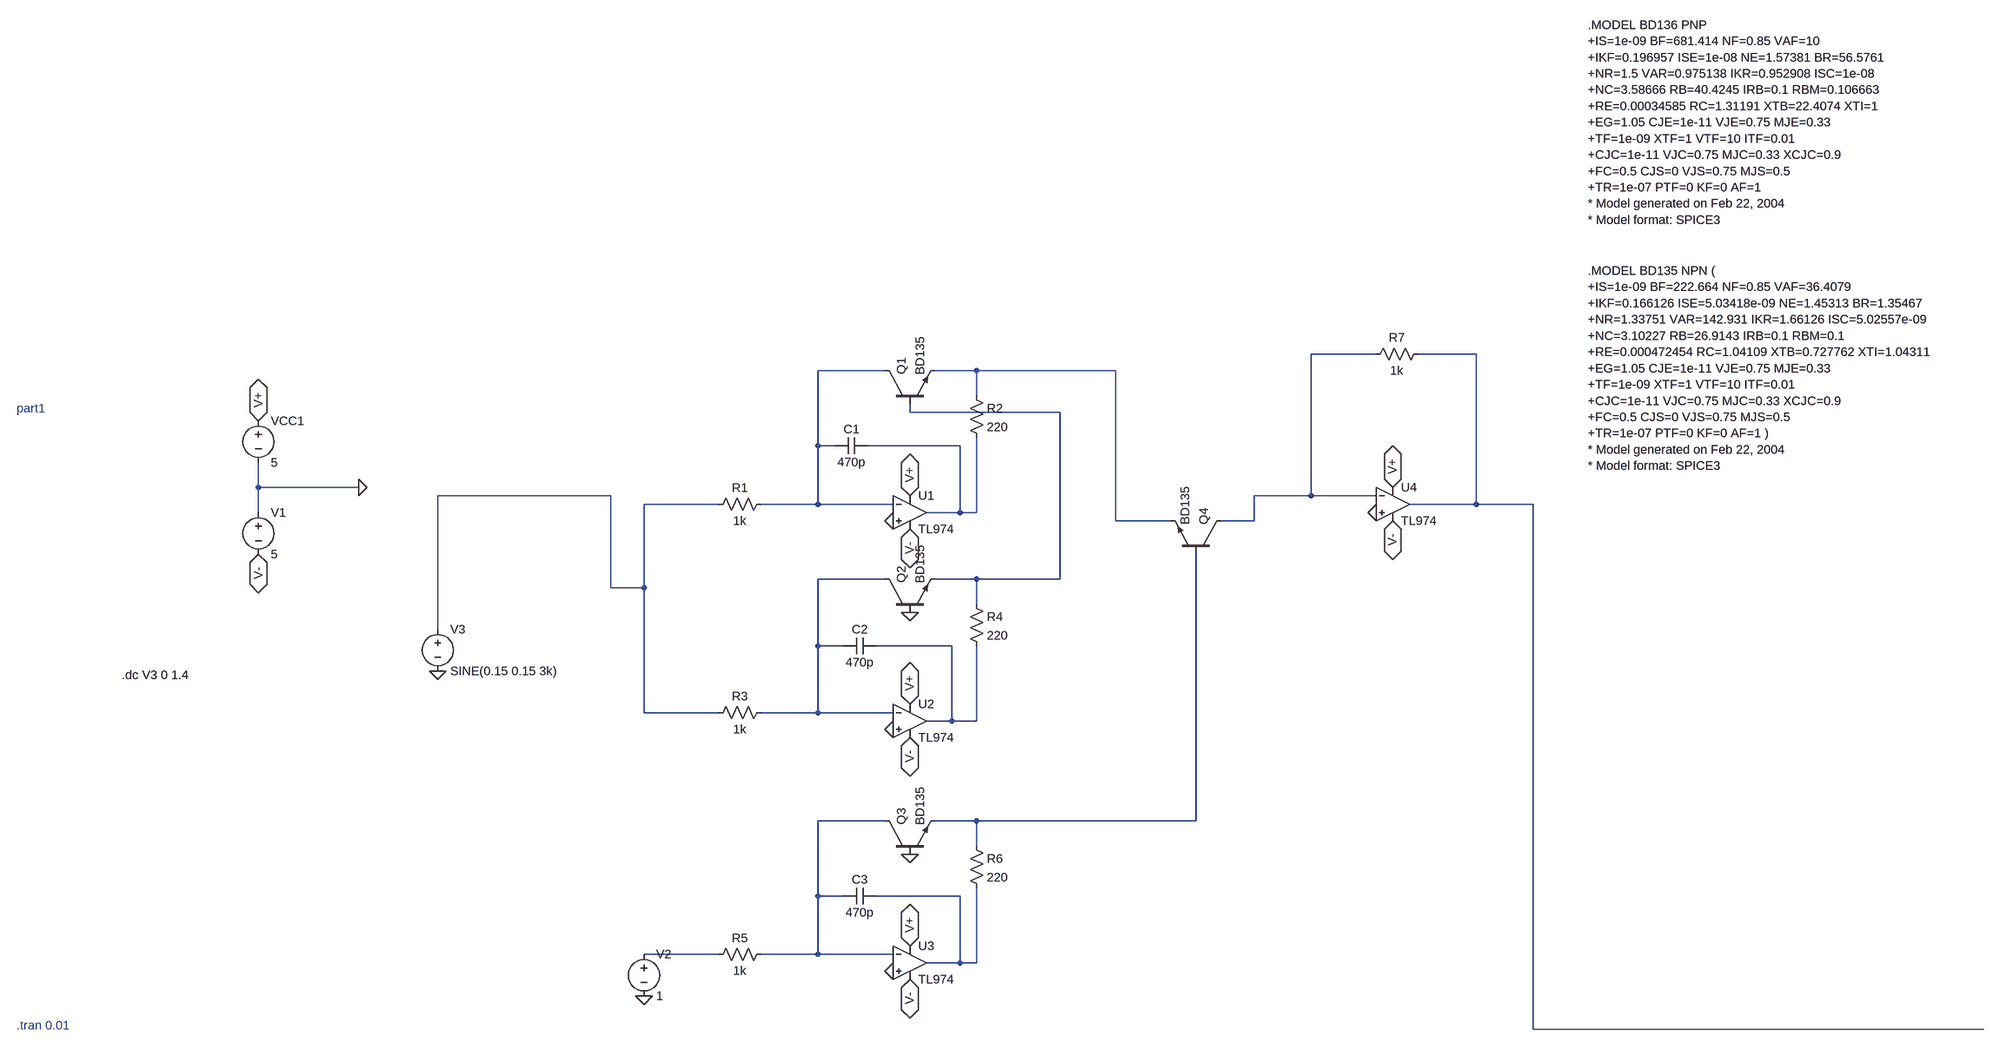
[diagram p0: schematic voltage_squarer.asc]
voltage_squarer.asc, the LTspice schematic file:
Version 4
SHEET 1 6148 1980
WIRE 848 -224 688 -224
WIRE 1040 -224 928 -224
WIRE -416 -192 -544 -192
WIRE -240 -192 -320 -192
WIRE 240 -192 -240 -192
WIRE -240 -144 -240 -192
WIRE -368 -112 -368 -128
WIRE -80 -112 -368 -112
WIRE -544 -48 -544 -192
WIRE -512 -48 -544 -48
WIRE -272 -48 -448 -48
WIRE -1904 32 -1904 -16
WIRE -1632 32 -1904 32
WIRE -992 48 -1440 48
WIRE 688 48 688 -224
WIRE 688 48 544 48
WIRE 848 48 688 48
WIRE -784 64 -928 64
WIRE -544 64 -544 -48
WIRE -544 64 -704 64
WIRE -400 64 -544 64
WIRE 1040 64 1040 -224
WIRE 1040 64 912 64
WIRE 1264 64 1040 64
WIRE -1904 80 -1904 32
WIRE -272 80 -272 -48
WIRE -272 80 -336 80
WIRE -240 80 -240 -64
WIRE -240 80 -272 80
WIRE 240 96 240 -192
WIRE 384 96 240 96
WIRE 544 96 544 48
WIRE 544 96 480 96
WIRE -416 208 -544 208
WIRE -240 208 -320 208
WIRE -80 208 -80 -112
WIRE -80 208 -240 208
WIRE -992 224 -992 48
WIRE -928 224 -928 64
WIRE -928 224 -992 224
WIRE -240 256 -240 208
WIRE -1440 304 -1440 48
WIRE -544 336 -544 208
WIRE -496 336 -544 336
WIRE -288 336 -432 336
WIRE -928 464 -928 224
WIRE -784 464 -928 464
WIRE -544 464 -544 336
WIRE -544 464 -704 464
WIRE -400 464 -544 464
WIRE -288 480 -288 336
WIRE -288 480 -336 480
WIRE -240 480 -240 336
WIRE -240 480 -288 480
WIRE -416 672 -544 672
WIRE -240 672 -320 672
WIRE 432 672 432 160
WIRE 432 672 -240 672
WIRE -240 720 -240 672
WIRE -544 816 -544 672
WIRE -496 816 -544 816
WIRE -272 816 -432 816
WIRE -784 928 -928 928
WIRE -544 928 -544 816
WIRE -544 928 -704 928
WIRE -400 928 -544 928
WIRE -272 944 -272 816
WIRE -272 944 -336 944
WIRE -240 944 -240 800
WIRE -240 944 -272 944
WIRE 1264 1072 1264 64
WIRE 3328 1072 1264 1072
FLAG -1632 32 0
FLAG -1904 -96 V+
IOPIN -1904 -96 BiDir
FLAG -1904 160 V-
IOPIN -1904 160 BiDir
FLAG -368 272 0
FLAG -400 496 0
FLAG -400 96 0
FLAG -368 48 V+
IOPIN -368 48 BiDir
FLAG -368 448 V+
IOPIN -368 448 BiDir
FLAG -368 112 V-
IOPIN -368 112 BiDir
FLAG -368 512 V-
IOPIN -368 512 BiDir
FLAG -368 736 0
FLAG -400 960 0
FLAG -368 912 V+
IOPIN -368 912 BiDir
FLAG -368 976 V-
IOPIN -368 976 BiDir
FLAG 848 80 0
FLAG 880 32 V+
IOPIN 880 32 BiDir
FLAG 880 96 V-
IOPIN 880 96 BiDir
FLAG -928 1008 0
FLAG -1440 384 0
SYMBOL TL974 -368 80 R0
SYMATTR InstName U1
SYMBOL voltage -1904 -112 R0
WINDOW 123 0 0 Left 0
WINDOW 39 0 0 Left 0
SYMATTR InstName VCC1
SYMATTR Value 5
SYMBOL voltage -1904 64 R0
WINDOW 123 0 0 Left 0
WINDOW 39 0 0 Left 0
SYMATTR InstName V1
SYMATTR Value 5
SYMBOL npn -416 -128 R270
SYMATTR InstName Q1
SYMATTR Value BD135
SYMBOL res -688 48 R90
WINDOW 0 0 56 VBottom 2
WINDOW 3 32 56 VTop 2
SYMATTR InstName R1
SYMATTR Value 1k
SYMBOL res -256 -160 R0
SYMATTR InstName R2
SYMATTR Value 220
SYMBOL TL974 -368 480 R0
SYMATTR InstName U2
SYMBOL npn -416 272 R270
SYMATTR InstName Q2
SYMATTR Value BD135
SYMBOL res -688 448 R90
WINDOW 0 0 56 VBottom 2
WINDOW 3 32 56 VTop 2
SYMATTR InstName R3
SYMATTR Value 1k
SYMBOL res -256 240 R0
SYMATTR InstName R4
SYMATTR Value 220
SYMBOL TL974 -368 944 R0
SYMATTR InstName U3
SYMBOL npn -416 736 R270
SYMATTR InstName Q3
SYMATTR Value BD135
SYMBOL res -688 912 R90
WINDOW 0 0 56 VBottom 2
WINDOW 3 32 56 VTop 2
SYMATTR InstName R5
SYMATTR Value 1k
SYMBOL res -256 704 R0
SYMATTR InstName R6
SYMATTR Value 220
SYMBOL npn 480 160 M270
SYMATTR InstName Q4
SYMATTR Value BD135
SYMBOL TL974 880 64 R0
SYMATTR InstName U4
SYMBOL res 944 -240 R90
WINDOW 0 0 56 VBottom 2
WINDOW 3 32 56 VTop 2
SYMATTR InstName R7
SYMATTR Value 1k
SYMBOL voltage -928 912 R0
WINDOW 123 0 0 Left 0
WINDOW 39 0 0 Left 0
SYMATTR InstName V2
SYMATTR Value 1
SYMBOL voltage -1440 288 R0
WINDOW 123 0 0 Left 0
WINDOW 39 0 0 Left 0
SYMATTR InstName V3
SYMATTR Value SINE(0.15 0.15 3k)
SYMBOL cap -448 -64 R90
WINDOW 0 0 32 VBottom 2
WINDOW 3 32 32 VTop 2
SYMATTR InstName C1
SYMATTR Value 470p
SYMBOL cap -432 320 R90
WINDOW 0 0 32 VBottom 2
WINDOW 3 32 32 VTop 2
SYMATTR InstName C2
SYMATTR Value 470p
SYMBOL cap -432 800 R90
WINDOW 0 0 32 VBottom 2
WINDOW 3 32 32 VTop 2
SYMATTR InstName C3
SYMATTR Value 470p
TEXT -2696 -120 Left 2 ;part1
TEXT 1664 -384 Left 2 !.MODEL BD135 NPN (\n+IS=1e-09 BF=222.664 NF=0.85 VAF=36.4079\n+IKF=0.166126 ISE=5.03418e-09 NE=1.45313 BR=1.35467\n+NR=1.33751 VAR=142.931 IKR=1.66126 ISC=5.02557e-09\n+NC=3.10227 RB=26.9143 IRB=0.1 RBM=0.1\n+RE=0.000472454 RC=1.04109 XTB=0.727762 XTI=1.04311\n+EG=1.05 CJE=1e-11 VJE=0.75 MJE=0.33\n+TF=1e-09 XTF=1 VTF=10 ITF=0.01\n+CJC=1e-11 VJC=0.75 MJC=0.33 XCJC=0.9\n+FC=0.5 CJS=0 VJS=0.75 MJS=0.5\n+TR=1e-07 PTF=0 KF=0 AF=1 )\n* Model generated on Feb 22, 2004\n* Model format: SPICE3
TEXT -2696 1064 Left 2 ;.tran 0.01
TEXT -2328 392 Left 2 !.dc V3 0 1.4
TEXT 1664 -856 Left 2 !.MODEL BD136 PNP\n+IS=1e-09 BF=681.414 NF=0.85 VAF=10\n+IKF=0.196957 ISE=1e-08 NE=1.57381 BR=56.5761\n+NR=1.5 VAR=0.975138 IKR=0.952908 ISC=1e-08\n+NC=3.58666 RB=40.4245 IRB=0.1 RBM=0.106663\n+RE=0.00034585 RC=1.31191 XTB=22.4074 XTI=1\n+EG=1.05 CJE=1e-11 VJE=0.75 MJE=0.33\n+TF=1e-09 XTF=1 VTF=10 ITF=0.01\n+CJC=1e-11 VJC=0.75 MJC=0.33 XCJC=0.9\n+FC=0.5 CJS=0 VJS=0.75 MJS=0.5\n+TR=1e-07 PTF=0 KF=0 AF=1\n* Model generated on Feb 22, 2004\n* Model format: SPICE3

The netlist it stands for:
* voltage_squarer.asc
* U1: TL974 (symbol TL974 not available, pins judged from their places): In+=0 In-=N003 V+=V+ V-=V- OUT=N006
VCC1 V+ 0 5
V1 0 V- 5
Q1 N003 N005 N004 0 BD135
R1 N003 N007 1k
R2 N004 N006 220
* U2: TL974 (symbol TL974 not available, pins judged from their places): In+=0 In-=N008 V+=V+ V-=V- OUT=N009
Q2 N008 0 N005 0 BD135
R3 N008 N007 1k
R4 N005 N009 220
* U3: TL974 (symbol TL974 not available, pins judged from their places): In+=0 In-=N010 V+=V+ V-=V- OUT=N012
Q3 N010 0 N011 0 BD135
R5 N010 N013 1k
R6 N011 N012 220
Q4 N001 N011 N004 0 BD135
* U4: TL974 (symbol TL974 not available, pins judged from their places): In+=0 In-=N001 V+=V+ V-=V- OUT=N002
R7 N002 N001 1k
V2 N013 0 1
V3 N007 0 SINE(0.15 0.15 3k)
C1 N006 N003 470p
C2 N009 N008 470p
C3 N012 N010 470p
.model NPN NPN
.model PNP PNP
.lib standard.bjt
* part1
.MODEL BD135 NPN (
+IS=1e-09 BF=222.664 NF=0.85 VAF=36.4079
+IKF=0.166126 ISE=5.03418e-09 NE=1.45313 BR=1.35467
+NR=1.33751 VAR=142.931 IKR=1.66126 ISC=5.02557e-09
+NC=3.10227 RB=26.9143 IRB=0.1 RBM=0.1
+RE=0.000472454 RC=1.04109 XTB=0.727762 XTI=1.04311
+EG=1.05 CJE=1e-11 VJE=0.75 MJE=0.33
+TF=1e-09 XTF=1 VTF=10 ITF=0.01
+CJC=1e-11 VJC=0.75 MJC=0.33 XCJC=0.9
+FC=0.5 CJS=0 VJS=0.75 MJS=0.5
+TR=1e-07 PTF=0 KF=0 AF=1 )
* Model generated on Feb 22, 2004
* Model format: SPICE3
* .tran 0.01
.dc V3 0 1.4
.MODEL BD136 PNP
+IS=1e-09 BF=681.414 NF=0.85 VAF=10
+IKF=0.196957 ISE=1e-08 NE=1.57381 BR=56.5761
+NR=1.5 VAR=0.975138 IKR=0.952908 ISC=1e-08
+NC=3.58666 RB=40.4245 IRB=0.1 RBM=0.106663
+RE=0.00034585 RC=1.31191 XTB=22.4074 XTI=1
+EG=1.05 CJE=1e-11 VJE=0.75 MJE=0.33
+TF=1e-09 XTF=1 VTF=10 ITF=0.01
+CJC=1e-11 VJC=0.75 MJC=0.33 XCJC=0.9
+FC=0.5 CJS=0 VJS=0.75 MJS=0.5
+TR=1e-07 PTF=0 KF=0 AF=1
* Model generated on Feb 22, 2004
* Model format: SPICE3
.backanno
.end